# EAGLE design BPW5025-CRAM_Wing (EAGLE 5.06)
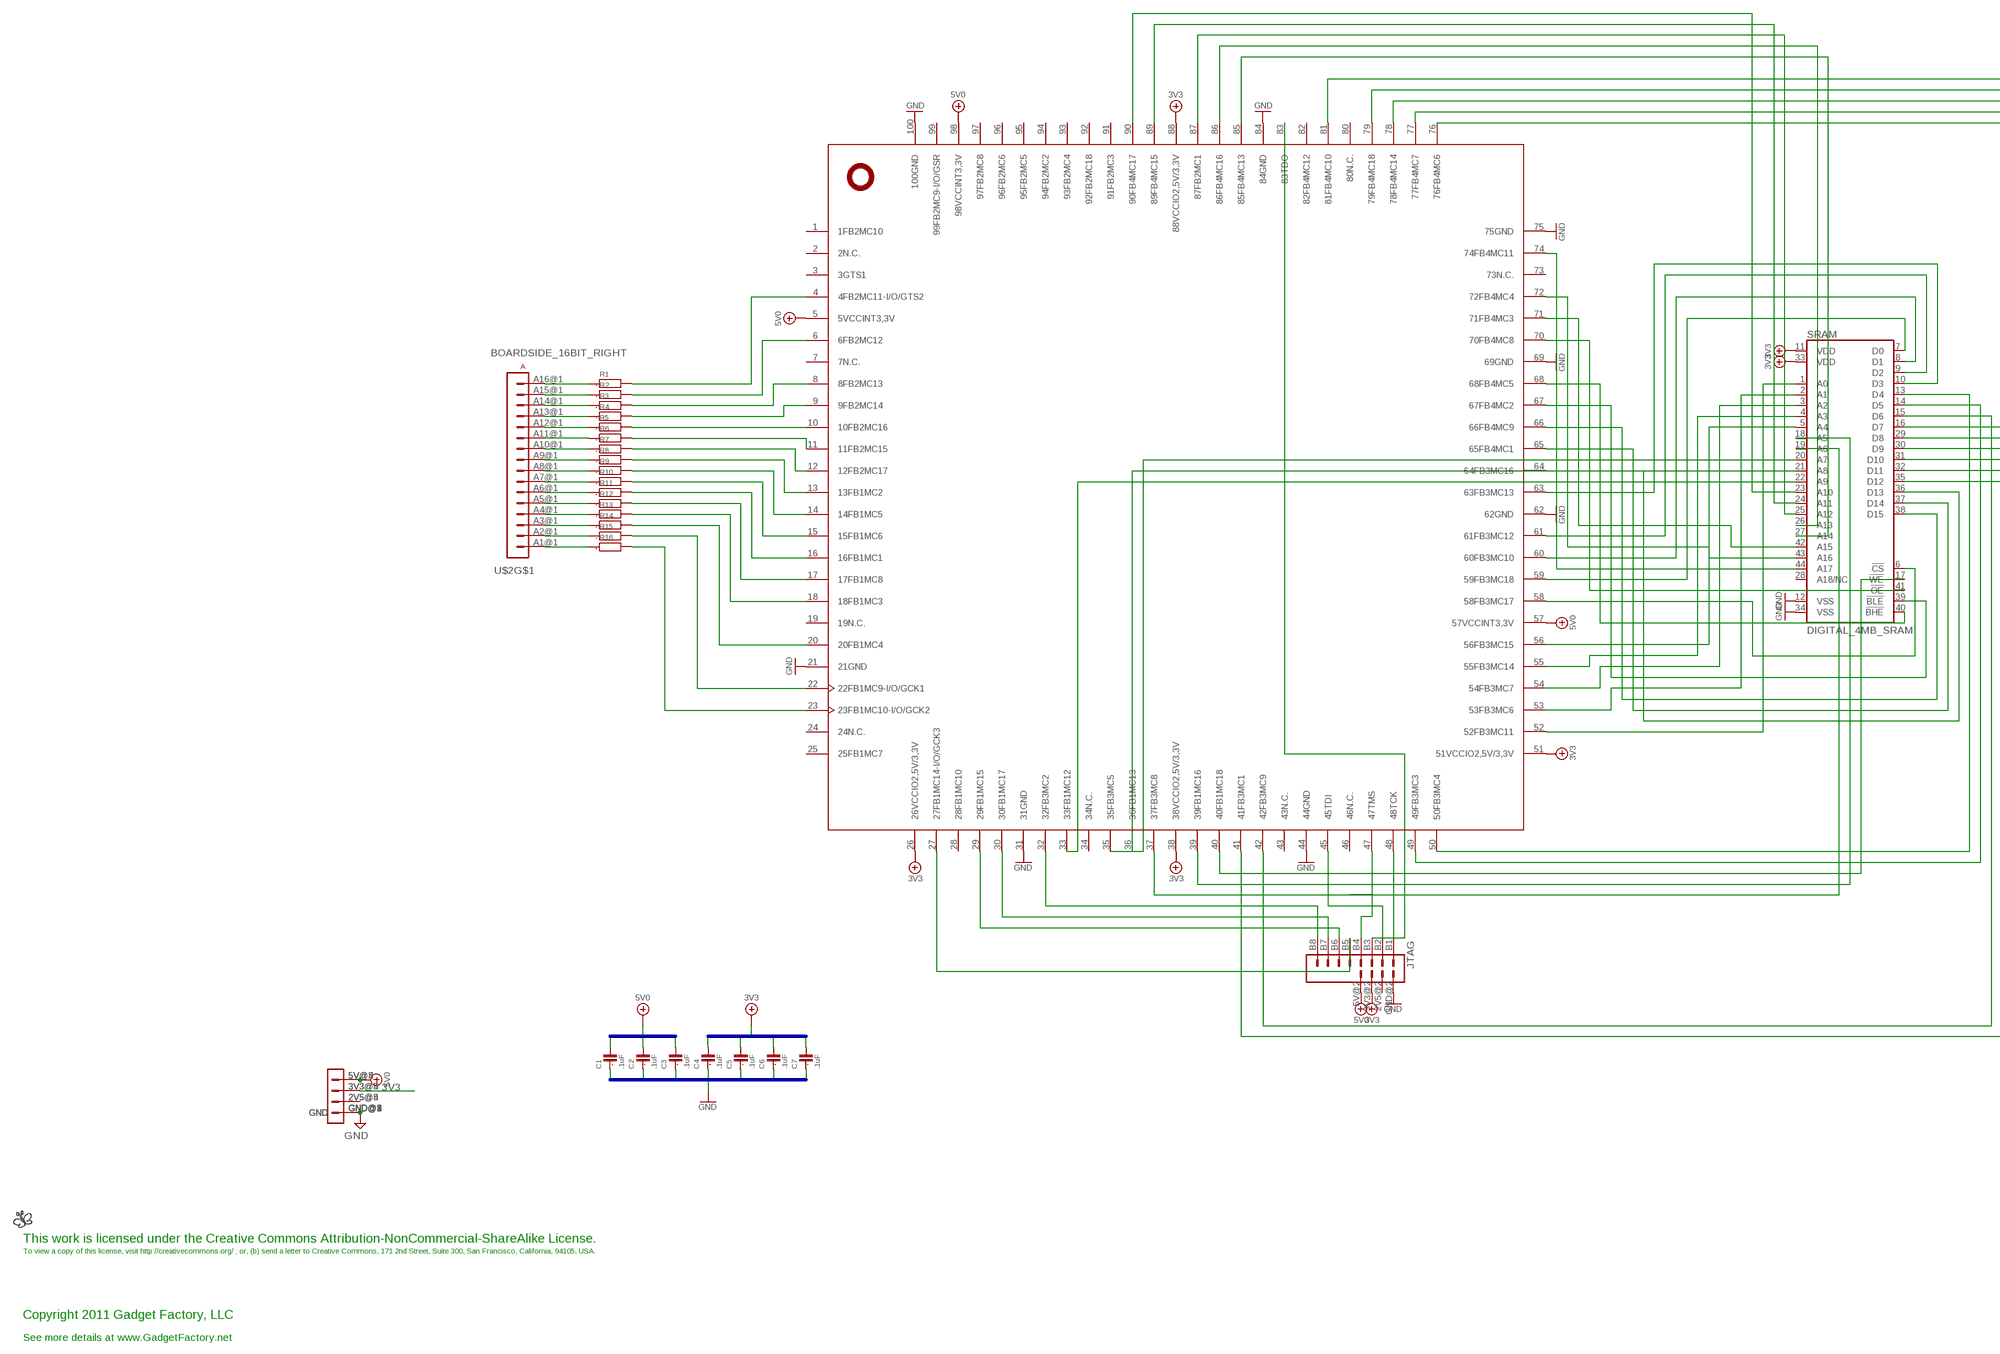
[diagram p0: schematic, sheet 1]

## Parts
C1  .1uF  C0805  [0805]
C2  .1uF  C0805  [0805]
C3  .1uF  C0805  [0805]
C4  .1uF  C0805  [0805]
C5  .1uF  C0805  [0805]
C6  .1uF  C0805  [0805]
C7  .1uF  C0805  [0805]
JTAG  WING_8BIT  [WINGSIDE_8BIT]
LOGO1  BUTTERFLY_LOGO  [BUTTERFLY_LOGO]
R1  R0603  [0603]
R2  R0603  [0603]
R3  R0603  [0603]
R4  R0603  [0603]
R5  R0603  [0603]
R6  R0603  [0603]
R7  R0603  [0603]
R8  R0603  [0603]
R9  R0603  [0603]
R10  R0603  [0603]
R11  R0603  [0603]
R12  R0603  [0603]
R13  R0603  [0603]
R14  R0603  [0603]
R15  R0603  [0603]
R16  R0603  [0603]
SRAM  DIGITAL_4MB_SRAM  [TSOP44-II]
U$2  BOARDSIDE_16BIT_RIGHT  [BOARDSIDE_16BIT_RIGHT]
XC9500  XC9572XLTQ100  [TQ100]

## Nets
3V3: C4.2 C5.2 C6.2 C7.2 JTAG.3V3@2(3V3) SRAM.11(VDD) SRAM.33(VDD) U$2.3V3@4(3V3) U$2.3V3@5(3V3) XC9500.26(26VCCIO2,5V/3,3V) XC9500.38(38VCCIO2,5V/3,3V) XC9500.51(51VCCIO2,5V/3,3V) XC9500.88(88VCCIO2,5V/3,3V)
5V0: C1.2 C2.2 C3.2 JTAG.5V@2(5V) U$2.5V@4(5V) U$2.5V@5(5V) XC9500.5(5VCCINT3,3V) XC9500.57(57VCCINT3,3V) XC9500.98(98VCCINT3,3V)
GND: C1.1 C2.1 C3.1 C4.1 C5.1 C6.1 C7.1 JTAG.GND@2(GND) SRAM.12(VSS) SRAM.34(VSS) U$2.GND@1(GND) U$2.GND@2(GND) U$2.GND@4(GND) U$2.GND@5(GND) XC9500.21(21GND) XC9500.31(31GND) XC9500.44(44GND) XC9500.62(62GND) XC9500.69(69GND) XC9500.75(75GND) XC9500.84(84GND) XC9500.100(100GND)
N$1: JTAG.B1 XC9500.48(48TCK)
N$2: R1.2 XC9500.4(4FB2MC11-I/O/GTS2)
N$3: U$2.2V5@4(2V5) U$2.2V5@5(2V5)
N$4: R2.2 XC9500.6(6FB2MC12)
N$5: R3.2 XC9500.8(8FB2MC13)
N$6: R4.2 XC9500.9(9FB2MC14)
N$7: R1.1 U$2.A16@1(A16)
N$8: R6.2 XC9500.11(11FB2MC15)
N$9: R7.2 XC9500.12(12FB2MC17)
N$10: R8.2 XC9500.13(13FB1MC2)
N$11: R9.2 XC9500.14(14FB1MC5)
N$12: R10.2 XC9500.15(15FB1MC6)
N$13: R11.2 XC9500.16(16FB1MC1)
N$14: R12.2 XC9500.17(17FB1MC8)
N$15: R13.2 XC9500.18(18FB1MC3)
N$16: R14.2 XC9500.20(20FB1MC4)
N$17: R15.2 XC9500.22(22FB1MC9-I/O/GCK1)
N$18: R16.2 XC9500.23(23FB1MC10-I/O/GCK2)
N$19: SRAM.1(A0) XC9500.52(52FB3MC11)
N$20: SRAM.2(A1) XC9500.53(53FB3MC6)
N$21: SRAM.3(A2) XC9500.54(54FB3MC7)
N$22: SRAM.4(A3) XC9500.55(55FB3MC14)
N$23: SRAM.6(!CS) XC9500.58(58FB3MC17)
N$24: SRAM.7(D0) XC9500.59(59FB3MC18)
N$25: SRAM.8(D1) XC9500.60(60FB3MC10)
N$26: SRAM.9(D2) XC9500.61(61FB3MC12)
N$27: SRAM.10(D3) XC9500.63(63FB3MC13)
N$28: SRAM.41(!OE) XC9500.70(70FB4MC8)
N$29: SRAM.44(A17) XC9500.74(74FB4MC11)
N$30: SRAM.43(A16) XC9500.72(72FB4MC4)
N$31: SRAM.42(A15) XC9500.71(71FB4MC3)
N$32: SRAM.40(!BHE) XC9500.68(68FB4MC5)
N$33: SRAM.39(!BLE) XC9500.67(67FB4MC2)
N$34: SRAM.38(D15) XC9500.66(66FB4MC9)
N$35: SRAM.37(D14) XC9500.65(65FB4MC1)
N$36: SRAM.36(D13) XC9500.64(64FB3MC16)
N$37: JTAG.B2 XC9500.45(45TDI)
N$39: JTAG.B4 XC9500.47(47TMS)
N$40: JTAG.B3 XC9500.83(83TDO)
N$41: SRAM.13(D4) XC9500.50(50FB3MC4)
N$42: SRAM.14(D5) XC9500.49(49FB3MC3)
N$43: SRAM.15(D6) XC9500.42(42FB3MC9)
N$44: SRAM.16(D7) XC9500.41(41FB3MC1)
N$45: SRAM.17(!WE) XC9500.40(40FB1MC18)
N$46: SRAM.18(A5) XC9500.39(39FB1MC16)
N$47: SRAM.19(A6) XC9500.37(37FB3MC8)
N$48: SRAM.20(A7) XC9500.36(36FB1MC13)
N$49: SRAM.21(A8) XC9500.35(35FB3MC5)
N$50: SRAM.22(A9) XC9500.33(33FB1MC12)
N$51: SRAM.35(D12) XC9500.76(76FB4MC6)
N$52: SRAM.32(D11) XC9500.77(77FB4MC7)
N$53: SRAM.31(D10) XC9500.78(78FB4MC14)
N$54: SRAM.30(D9) XC9500.79(79FB4MC18)
N$55: SRAM.29(D8) XC9500.81(81FB4MC10)
N$56: SRAM.27(A14) XC9500.85(85FB4MC13)
N$57: SRAM.26(A13) XC9500.86(86FB4MC16)
N$58: SRAM.25(A12) XC9500.87(87FB2MC1)
N$59: SRAM.24(A11) XC9500.89(89FB4MC15)
N$60: SRAM.23(A10) XC9500.90(90FB4MC17)
N$61: SRAM.5(A4) XC9500.56(56FB3MC15)
N$62: JTAG.B8 XC9500.32(32FB3MC2)
N$63: JTAG.B7 XC9500.30(30FB1MC17)
N$64: JTAG.B6 XC9500.29(29FB1MC15)
N$65: JTAG.B5 XC9500.27(27FB1MC14-I/O/GCK3)
N$66: R2.1 U$2.A15@1(A15)
N$67: R3.1 U$2.A14@1(A14)
N$68: R4.1 U$2.A13@1(A13)
N$69: R5.1 U$2.A12@1(A12)
N$70: R6.1 U$2.A11@1(A11)
N$71: R7.1 U$2.A10@1(A10)
N$72: R8.1 U$2.A9@1(A9)
N$73: R9.1 U$2.A8@1(A8)
N$74: R10.1 U$2.A7@1(A7)
N$75: R11.1 U$2.A6@1(A6)
N$76: R12.1 U$2.A5@1(A5)
N$77: R13.1 U$2.A4@1(A4)
N$78: R14.1 U$2.A3@1(A3)
N$79: R15.1 U$2.A2@1(A2)
N$80: R16.1 U$2.A1@1(A1)
N$81: R5.2 XC9500.10(10FB2MC16)
Unconnected: JTAG.2V5@2(2V5) SRAM.28(A18/NC) XC9500.1(1FB2MC10) XC9500.2(2N.C.) XC9500.3(3GTS1) XC9500.7(7N.C.) XC9500.19(19N.C.) XC9500.24(24N.C.) XC9500.25(25FB1MC7) XC9500.28(28FB1MC10) XC9500.34(34N.C.) XC9500.43(43N.C.) XC9500.46(46N.C.) XC9500.73(73N.C.) XC9500.80(80N.C.) XC9500.82(82FB4MC12) XC9500.91(91FB2MC3) XC9500.92(92FB2MC18) XC9500.93(93FB2MC4) XC9500.94(94FB2MC2) XC9500.95(95FB2MC5) XC9500.96(96FB2MC6) XC9500.97(97FB2MC8) XC9500.99(99FB2MC9-I/O/GSR)

## Buses
GND
5V0
3V3

## Notes on the sheet
- This work is licensed under the Creative Commons Attribution-NonCommercial-ShareAlike License.
- To view a copy of this license, visit http://creativecommons.org/ ; or, (b) send a letter to Creative Commons, 171 2nd Street, Suite 300, San Francisco, California, 94105, USA.
- Copyright 2011 Gadget Factory, LLC
- See more details at www.GadgetFactory.net

## Library data of the parts
C1-C7 = GadgetFactory:C: CAPACITOR, European symbol
JTAG = GadgetFactory_Pub:WING_8BIT
LOGO1 = GadgetFactory_Pub:BUTTERFLY_LOGO
R1-R16 = GadgetFactory:R: RESISTOR, European symbol
SRAM = Bogdan_Commons:DIGITAL_4MB_SRAM
U$2 = GadgetFactory_Pub:BOARDSIDE_16BIT_RIGHT
XC9500 = xilinx_xc9572xl-tq100:XC9572XLTQ100

## Board
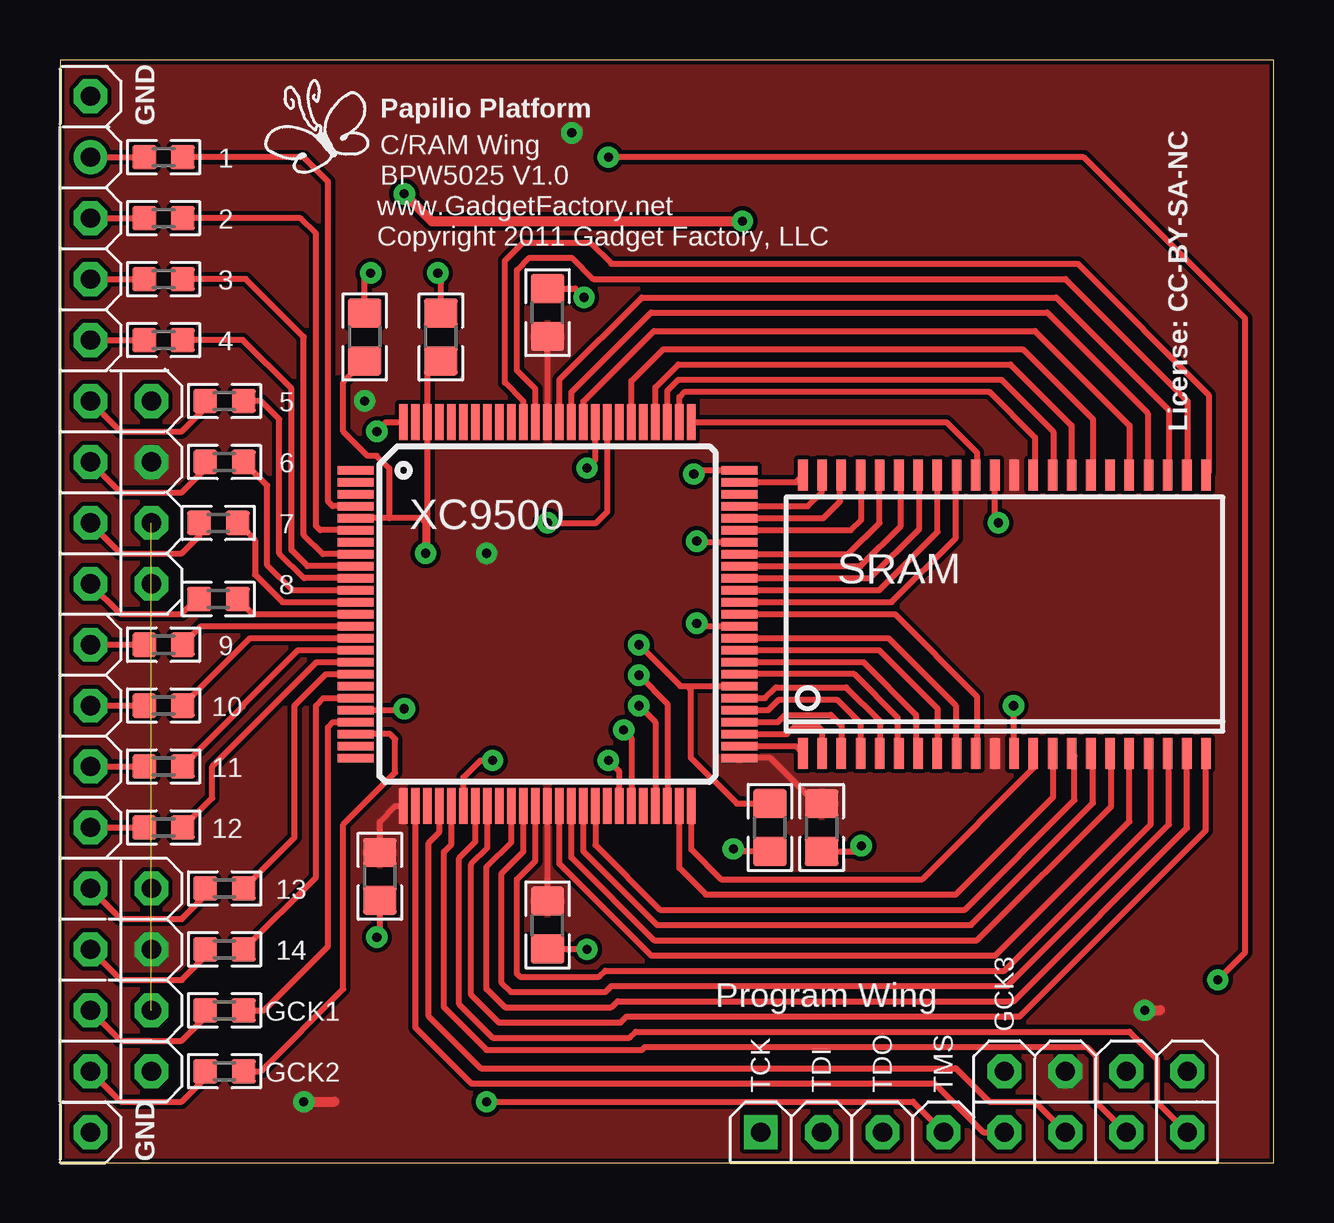
[diagram p1: board, top side]
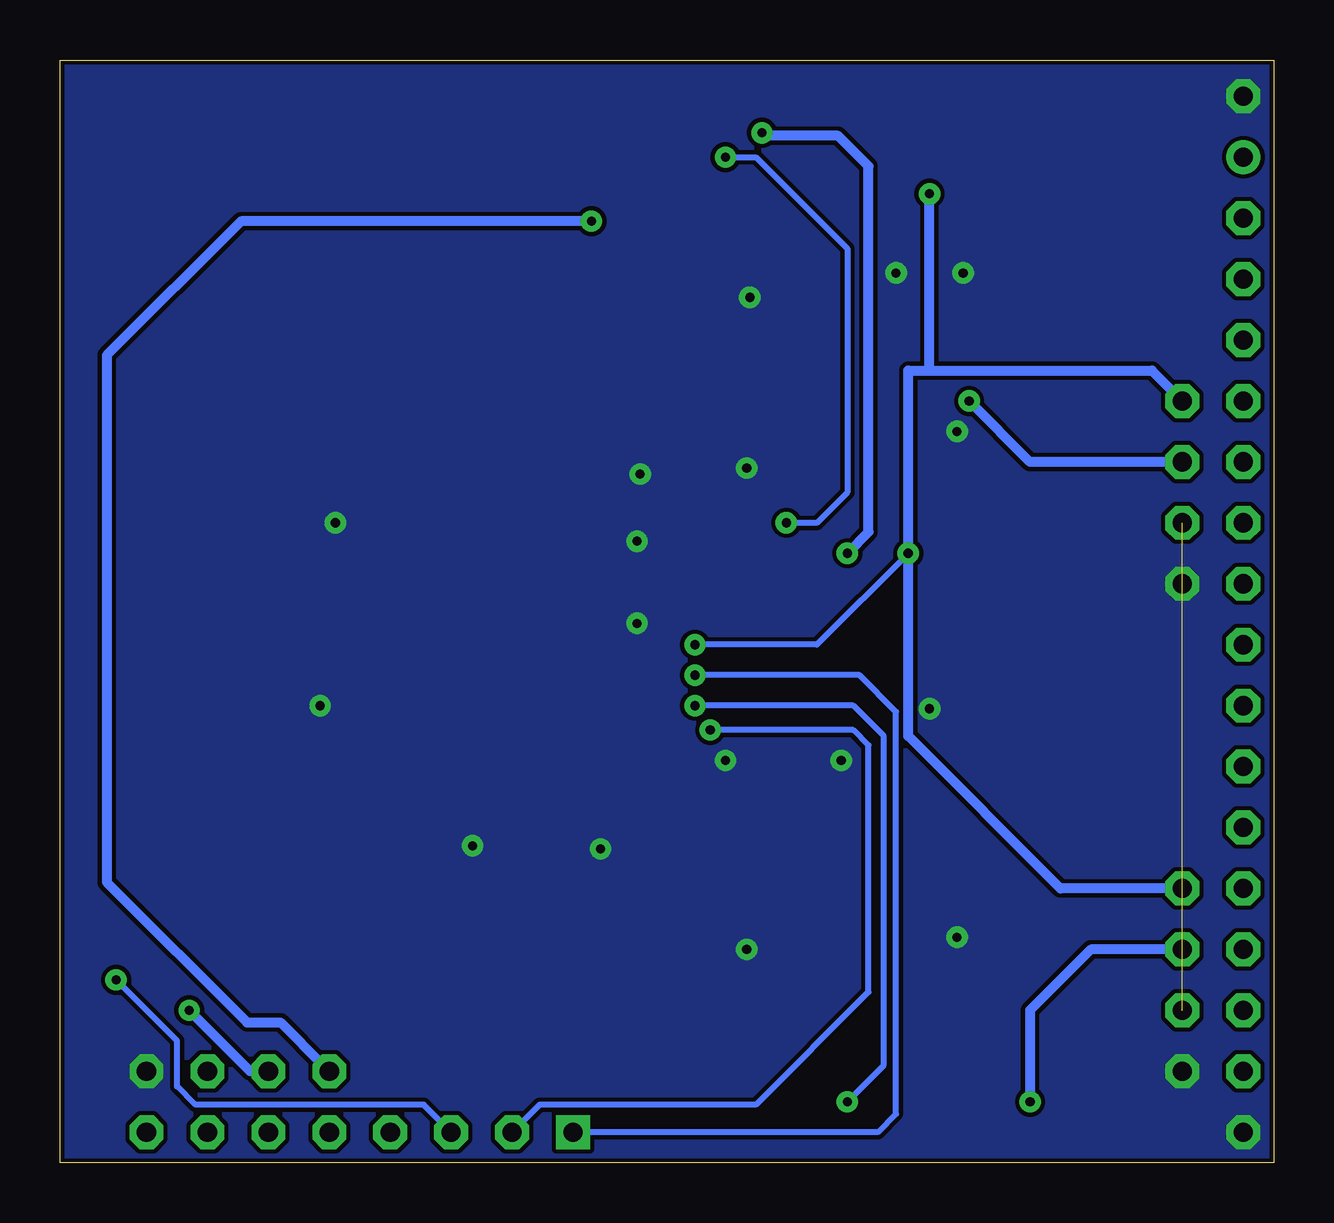
[diagram p2: board, bottom side, seen from below]

Size 50.6 x 45.96 mm. Coordinates in mm from the lower left corner, seen from the top.
Outline: 0,0 50.6,0 50.6,45.96 0,45.96 0,0
Copper layers (1*16): Top 0.035mm / dielectric 1.5mm / Bottom 0.035mm
Design rules "SparkFun_Derived_GoldePheonix_7mil *": minimum track width 7mil, minimum drill 15mil, track to track 7mil, track to pad 7mil, pad to pad 7mil, via to via 7mil, smd to smd 7mil, copper to edge 7mil, drill to drill 7mil, minimum pad ring 12mil, minimum via ring 10mil, stop-mask expansion 4mil, vias tented up to drill 18mil, thermal gap 1mil

### Footprints (pad centres in the part's own frame; a part is rotated, then mirrored left to right if it is on the bottom)
0805 = smd 1.2 x 1.4: 1 -1,0; 2 1,0
WINGSIDE_8BIT = drill 0.8 octagon: 2V5@2 16.51,3.81; 3V3@2 13.97,3.81; 5V@2 11.43,3.81; B2 3.81,1.27; B3 6.35,1.27; B4 8.89,1.27; B5 11.43,1.27; B6 13.97,1.27; B7 16.51,1.27; B8 19.05,1.27; GND@2 19.05,3.81 | drill 0.8 square: B1 1.27,1.27
0603 = smd 1 x 1: 1 -0.8,0; 2 0.8,0
TSOP44-II = smd 0.4 x 1.3: 1 -8.4,-5.8; 2 -7.6,-5.8; 3 -6.8,-5.8; 4 -6,-5.8; 5 -5.2,-5.8; 6 -4.4,-5.8; 7 -3.6,-5.8; 8 -2.8,-5.8; 9 -2,-5.8; 10 -1.2,-5.8; 11 -0.4,-5.8; 12 0.4,-5.8; 13 1.2,-5.8; 14 2,-5.8; 15 2.8,-5.8; 16 3.6,-5.8; 17 4.4,-5.8; 18 5.2,-5.8; 19 6,-5.8; 20 6.8,-5.8; 21 7.6,-5.8; 22 8.4,-5.8; 23 8.4,5.8; 24 7.6,5.8; 25 6.8,5.8; 26 6,5.8; 27 5.2,5.8; 28 4.4,5.8; 29 3.6,5.8; 30 2.8,5.8; 31 2,5.8; 32 1.2,5.8; 33 0.4,5.8; 34 -0.4,5.8; 35 -1.2,5.8; 36 -2,5.8; 37 -2.8,5.8; 38 -3.6,5.8; 39 -4.4,5.8; 40 -5.2,5.8; 41 -6,5.8; 42 -6.8,5.8; 43 -7.6,5.8; 44 -8.4,5.8
BOARDSIDE_16BIT_RIGHT = drill 0.8 octagon: 2V5@4 3.81,-16.51; 2V5@5 3.81,3.81; 3V3@4 3.81,-13.97; 3V3@5 3.81,6.35; 5V@4 3.81,-11.43; 5V@5 3.81,8.89; A1@1 1.27,-19.05; A2@1 1.27,-16.51; A3@1 1.27,-13.97; A4@1 1.27,-11.43; A5@1 1.27,-8.89; A6@1 1.27,-6.35; A7@1 1.27,-3.81; A8@1 1.27,-1.27; A9@1 1.27,1.27; A10@1 1.27,3.81; A11@1 1.27,6.35; A12@1 1.27,8.89; A13@1 1.27,11.43; A14@1 1.27,13.97; A15@1 1.27,16.51; GND@1 1.27,-21.59; GND@2 1.27,21.59; GND@4 3.81,-19.05; GND@5 3.81,1.27 | drill 0.8 round: A16@1 1.27,19.05
TQ100 = smd 1.5 x 0.35: 1 -4.19,3.46; 2 -4.19,2.96; 3 -4.19,2.46; 4 -4.19,1.96; 5 -4.19,1.46; 6 -4.19,0.96; 7 -4.19,0.46; 8 -4.19,-0.04; 9 -4.19,-0.54; 10 -4.19,-1.04; 11 -4.19,-1.54; 12 -4.19,-2.04; 13 -4.19,-2.54; 14 -4.19,-3.04; 15 -4.19,-3.54; 16 -4.19,-4.04; 17 -4.19,-4.54; 18 -4.19,-5.04; 19 -4.19,-5.54; 20 -4.19,-6.04; 21 -4.19,-6.54; 22 -4.19,-7.04; 23 -4.19,-7.54; 24 -4.19,-8.04; 25 -4.19,-8.54; 51 11.81,-8.54; 52 11.81,-8.04; 53 11.81,-7.54; 54 11.81,-7.04; 55 11.81,-6.54; 56 11.81,-6.04; 57 11.81,-5.54; 58 11.81,-5.04; 59 11.81,-4.54; 60 11.81,-4.04; 61 11.81,-3.54; 62 11.81,-3.04; 63 11.81,-2.54; 64 11.81,-2.04; 65 11.81,-1.54; 66 11.81,-1.04; 67 11.81,-0.54; 68 11.81,-0.04; 69 11.81,0.46; 70 11.81,0.96; 71 11.81,1.46; 72 11.81,1.96; 73 11.81,2.46; 74 11.81,2.96; 75 11.81,3.46 | smd 0.35 x 1.5: 26 -2.19,-10.54; 27 -1.69,-10.54; 28 -1.19,-10.54; 29 -0.69,-10.54; 30 -0.19,-10.54; 31 0.31,-10.54; 32 0.81,-10.54; 33 1.31,-10.54; 34 1.81,-10.54; 35 2.31,-10.54; 36 2.81,-10.54; 37 3.31,-10.54; 38 3.81,-10.54; 39 4.31,-10.54; 40 4.81,-10.54; 41 5.31,-10.54; 42 5.81,-10.54; 43 6.31,-10.54; 44 6.81,-10.54; 45 7.31,-10.54; 46 7.81,-10.54; 47 8.31,-10.54; 48 8.81,-10.54; 49 9.31,-10.54; 50 9.81,-10.54; 76 9.81,5.46; 77 9.31,5.46; 78 8.81,5.46; 79 8.31,5.46; 80 7.81,5.46; 81 7.31,5.46; 82 6.81,5.46; 83 6.31,5.46; 84 5.81,5.46; 85 5.31,5.46; 86 4.81,5.46; 87 4.31,5.46; 88 3.81,5.46; 89 3.31,5.46; 90 2.81,5.46; 91 2.31,5.46; 92 1.81,5.46; 93 1.31,5.46; 94 0.81,5.46; 95 0.31,5.46; 96 -0.19,5.46; 97 -0.69,5.46; 98 -1.19,5.46; 99 -1.69,5.46; 100 -2.19,5.46

### Placement (x,y rotation side)
C1  12.7,34.42 270 top
C2  29.59,13.97 90 top
C3  15.88,34.42 270 top
C4  13.34,11.94 90 top
C5  20.32,9.91 90 top
C6  31.75,13.97 90 top
C7  20.32,35.43 270 top
JTAG  27.94,0 0 top
LOGO1  10.79,42.67 0 top
R1  4.32,41.91 0 top
R2  4.32,39.37 0 top
R3  4.32,36.83 0 top
R4  4.32,34.29 0 top
R5  6.86,31.75 0 top
R6  6.86,29.21 0 top
R7  6.6,26.67 0 top
R8  6.6,23.5 0 top
R9  4.32,21.59 0 top
R10  4.32,19.05 0 top
R11  4.32,16.51 0 top
R12  4.32,13.97 0 top
R13  6.86,11.43 0 top
R14  6.86,8.89 0 top
R15  6.86,6.35 0 top
R16  6.86,3.81 0 top
SRAM  39.37,22.86 0 top
U$2  0,22.86 0 top
XC9500  16.51,25.4 0 top

### Tracks (layer width: path | path; a pad name or v marks a point on that pad's centre or on a via)
3V3  (via drill 0.38)
  Top 0.254: XC9500.88 C7.2 | C6.2 31.75,15.24 31.24,15.24 29.62,16.86 XC9500.51 | C5.2 XC9500.38 | XC9500.26 13.97,14.86 13.34,14.22 C4.2
  Top 0.406: v10.16,2.54 11.43,2.54 | v12.7,31.75 12.95,31.75 | v45.21,6.35 45.85,6.35 | v21.34,42.93 21.46,42.93 21.59,43.05
  Bottom 0.406: U$2.3V3@4 7.62,8.89 10.16,6.35 v10.16,2.54 | U$2.3V3@5 10.16,29.21 v12.7,31.75 | JTAG.3V3@2 42.67,3.81 v45.21,6.35 | v21.34,42.93 21.21,42.8 18.16,42.8 16.89,41.53 16.89,26.29 v17.78,25.4
  pour Top: 0.13,45.85 50.42,45.85 50.42,0.13 0.13,0.13
5V0  (via drill 0.38)
  Top 0.254: 13.74,26.86 15.05,26.86 15.24,26.67 v15.24,25.4 15.32,25.48 XC9500.98 15.32,32.86 C3.2 | 13.74,26.86 XC9500.5 | 26.16,19.86 25.86,19.86 v24.13,21.59 | 26.16,19.86 XC9500.57 | 13.74,26.86 13.74,28.94 13.21,29.46 12.83,29.46 11.81,30.48 11.81,32.53 C1.2 | 26.16,19.86 26.29,19.73 26.29,16.89 28.21,14.97 C2.2
  Top 0.406: v28.45,39.24 15.49,39.24 v14.35,40.39
  Bottom 0.254: v24.13,21.59 19.05,21.59 v15.24,25.4
  Bottom 0.406: U$2.5V@4 8.89,11.43 15.24,17.78 v15.24,25.4 15.24,33.02 14.48,33.02 | JTAG.5V@2 39.62,3.81 39.62,4.06 41.4,5.84 42.8,5.84 48.64,11.68 48.64,33.66 43.05,39.24 v28.45,39.24 | v14.35,40.39 14.35,33.15 14.48,33.02 | 14.48,33.02 5.08,33.02 U$2.5V@5
GND  (via drill 0.38)
  Top 0.254: SRAM.34 38.97,26.82 v39.12,26.67 | SRAM.12 39.77,19.03 v39.75,19.05 | XC9500.75 26.57,28.86 v26.42,28.7 | XC9500.69 26.59,25.86 v26.54,25.91 | XC9500.62 26.66,22.36 v26.54,22.48 | XC9500.84 22.32,29.3 v21.97,28.96 | XC9500.21 14.29,18.86 v14.35,18.92 | XC9500.31 16.82,16.06 17.53,16.76 v18.03,16.76 | XC9500.44 23.32,16.3 v22.86,16.76 | XC9500.100 13.59,30.86 v13.21,30.48 | C1.1 12.7,36.83 v12.95,37.08 | C3.1 15.88,36.96 v15.75,37.08 | C4.1 13.34,9.53 v13.21,9.4 | C5.1 21.95,8.91 v21.97,8.89 | C2.1 28.18,12.97 v28.07,13.08 | C6.1 33.16,12.97 v33.4,13.21 | C7.1 21.48,36.43 v21.84,36.07
  Bottom 0.254: v39.12,26.67 39.24,26.67 | v39.75,19.05 39.88,19.18 | v26.42,28.7 26.42,28.57 | v26.54,25.91 26.54,26.04 | v26.54,22.48 26.54,22.61 | v21.97,28.96 21.84,28.96 | v14.35,18.92 14.35,19.05 | v18.03,16.76 18.16,16.76 | v22.86,16.76 22.73,16.76 | 13.21,30.35 v13.21,30.48 | v12.95,37.08 13.21,37.08 | v15.75,37.08 15.62,37.08 | v13.21,9.4 13.08,9.4 | v21.97,8.89 21.97,8.76 | v28.07,13.08 28.19,13.21 | v33.4,13.21 33.4,13.34 | v21.84,36.07 21.84,35.81
  pour Bottom: 0.13,45.85 50.42,45.85 50.42,0.13 0.13,0.13
N$1  (via drill 0.38)
  Top 0.254: XC9500.48 25.32,19.13 v24.13,20.32
  Bottom 0.254: v24.13,20.32 17.27,20.32 15.75,18.8 15.75,2.03 16.51,1.27 JTAG.B1
N$2
  Top 0.254: XC9500.4 11.38,27.36 11.18,27.56 11.18,40.89 10.16,41.91 R1.2
N$3  (1 unrouted)
N$4
  Top 0.254: XC9500.6 10.85,26.36 10.67,26.54 10.67,38.73 10.03,39.37 R2.2
N$5
  Top 0.254: XC9500.8 10.96,25.36 10.16,26.16 10.16,34.42 7.75,36.83 R3.2
N$6
  Top 0.254: XC9500.9 10.32,24.86 9.65,25.53 9.65,32.26 7.62,34.29 R4.2
N$7
  Top 0.254: U$2.A16@1 R1.1
N$8
  Top 0.254: XC9500.11 9.67,23.86 8.64,24.89 8.64,28.23 R6.2
N$9
  Top 0.254: XC9500.12 9.28,23.36 8.13,24.51 8.13,25.95 R7.2
N$10
  Top 0.254: XC9500.13 8.04,22.86 R8.2
N$11
  Top 0.254: XC9500.14 5.89,22.36 R9.2
N$12
  Top 0.254: XC9500.15 7.93,21.86 R10.2
N$13
  Top 0.254: XC9500.16 9.93,21.36 7.62,19.05 7.62,19.01 R11.2
N$14
  Top 0.254: XC9500.17 10.7,20.86 6.35,16.51 6.35,15.2 R12.2
N$15
  Top 0.254: XC9500.18 11.09,20.36 9.78,19.05 9.78,13.55 R13.2
N$16
  Top 0.254: XC9500.20 10.98,19.36 10.67,19.05 10.67,11.9 R14.2
N$17
  Top 0.254: XC9500.22 11.38,18.36 11.18,18.16 11.18,9.02 8.51,6.35 R15.2
N$18
  Top 0.254: XC9500.23 13.76,17.86 13.97,17.65 13.97,16.26 11.81,14.1 11.81,7.24 8.38,3.81 R16.2
N$19
  Top 0.254: XC9500.52 30.67,17.36 SRAM.1
N$20
  Top 0.254: SRAM.2 31.77,18.01 31.62,18.16 30.61,18.16 30.31,17.86 XC9500.53
N$21
  Top 0.254: XC9500.54 29.92,18.36 30.23,18.67 32.13,18.67 32.57,18.23 SRAM.3
N$22
  Top 0.254: XC9500.55 29.53,18.86 29.97,19.3 32.38,19.3 33.37,18.32 SRAM.4
N$23
  Top 0.254: XC9500.58 33.11,20.36 34.92,18.54 34.92,17.11 SRAM.6
N$24
  Top 0.254: XC9500.59 33.5,20.86 35.69,18.67 35.69,17.14 SRAM.7
N$25
  Top 0.254: XC9500.60 34.14,21.36 36.58,18.92 SRAM.8
N$26
  Top 0.254: XC9500.61 34.53,21.86 37.34,19.05 37.34,17.09 SRAM.9
N$27
  Top 0.254: XC9500.63 34.8,22.86 38.23,19.43 38.23,17.12 SRAM.10
N$28
  Top 0.254: XC9500.70 32.96,26.36 33.4,26.8 33.4,28.63 SRAM.41
N$29
  Top 0.254: XC9500.74 30.67,28.36 SRAM.44
N$30
  Top 0.254: XC9500.72 31.17,27.36 31.75,27.94 31.75,28.64 SRAM.43
N$31
  Top 0.254: XC9500.71 31.81,26.86 32.51,27.56 32.51,28.6 SRAM.42
N$32
  Top 0.254: XC9500.68 32.85,25.36 34.16,26.67 SRAM.40
N$33
  Top 0.254: XC9500.67 33.37,24.86 35.05,26.54 35.05,28.58 SRAM.39
N$34
  Top 0.254: XC9500.66 33.76,24.36 35.81,26.42 35.81,28.62 SRAM.38
N$35
  Top 0.254: XC9500.65 34.15,23.86 36.58,26.29 SRAM.37
N$36
  Top 0.254: XC9500.64 34.66,23.36 37.34,26.04 37.34,28.63 SRAM.36
N$37  (via drill 0.38)
  Top 0.254: XC9500.45 23.82,17.71 v23.5,18.03
  Bottom 0.254: v23.5,18.03 17.53,18.03 16.89,17.4 16.89,7.11 21.59,2.41 30.61,2.41 JTAG.B2
N$39  (via drill 0.38)
  Top 0.254: XC9500.47 24.82,18.36 v24.13,19.05 | v17.78,2.54 35.56,2.54 JTAG.B4
  Bottom 0.254: v24.13,19.05 17.53,19.05 16.26,17.78 16.26,4.06 v17.78,2.54
N$40  (via drill 0.38)
  Top 0.254: XC9500.83 22.82,27.14 22.35,26.67 v20.32,26.67 | v22.86,41.91 42.67,41.91 49.4,35.18 49.4,8.76 v48.26,7.62
  Bottom 0.254: v20.32,26.67 19.05,26.67 17.78,27.94 17.78,38.1 21.59,41.91 v22.86,41.91 | JTAG.B3 35.43,2.41 44.96,2.41 45.72,3.17 45.72,5.08 v48.26,7.62
N$41
  Top 0.254: SRAM.13 40.64,16.99 40.64,16.51 35.94,11.81 27.56,11.81 26.32,13.05 XC9500.50
N$42
  Top 0.254: SRAM.14 41.4,17.03 41.4,15.24 37.34,11.18 26.92,11.18 25.82,12.28 XC9500.49
N$43
  Top 0.254: SRAM.15 42.29,16.94 42.29,15.11 37.72,10.54 25.02,10.54 22.32,13.24 XC9500.42
N$44
  Top 0.254: SRAM.16 43.05,16.98 43.05,14.99 37.97,9.91 24.89,9.91 21.82,12.98 XC9500.41
N$45
  Top 0.254: SRAM.17 43.81,17.02 43.81,14.86 38.23,9.27 24.77,9.27 21.32,12.72 XC9500.40
N$46
  Top 0.254: SRAM.18 44.58,14.22 38.99,8.64 24.64,8.64 20.82,12.45 XC9500.39
N$47
  Top 0.254: SRAM.19 45.47,16.96 45.47,14.1 39.37,8 22.73,8 22.48,7.75 19.18,7.75 19.05,7.87 19.05,11.81 19.82,12.58 XC9500.37
N$48
  Top 0.254: SRAM.20 46.23,17 46.23,14.1 39.5,7.37 22.99,7.37 22.73,7.11 18.8,7.11 18.41,7.49 18.41,12.06 19.32,12.97 XC9500.36
N$49
  Top 0.254: SRAM.21 46.97,13.95 39.75,6.73 23.24,6.73 22.99,6.48 18.54,6.48 17.78,7.24 17.78,12.32 18.82,13.36 XC9500.35
N$50
  Top 0.254: SRAM.22 47.75,17.04 47.75,13.84 40.01,6.1 23.62,6.1 23.37,5.84 18.29,5.84 17.14,6.99 17.14,12.45 17.82,13.12 XC9500.33
N$51
  Top 0.254: XC9500.76 36.96,30.86 38.23,29.59 38.23,28.72 SRAM.35
N$52
  Top 0.254: XC9500.77 25.82,31.92 26.04,32.13 38.73,32.13 40.64,30.23 40.64,28.73 SRAM.32
N$53
  Top 0.254: XC9500.78 25.32,32.18 25.78,32.64 39.24,32.64 41.4,30.48 41.4,28.69 SRAM.31
N$54
  Top 0.254: XC9500.79 24.82,32.31 25.78,33.27 39.62,33.27 42.16,30.73 SRAM.30
N$55
  Top 0.254: XC9500.81 23.82,32.58 25.15,33.91 40.13,33.91 43.05,30.99 43.05,28.74 SRAM.29
N$56
  Top 0.254: XC9500.85 21.82,31.73 24.77,34.67 40.64,34.67 44.58,30.73 SRAM.27
N$57
  Top 0.254: XC9500.86 21.32,32.12 24.64,35.43 41.15,35.43 45.34,31.24 45.34,28.69 SRAM.26
N$58
  Top 0.254: XC9500.87 20.82,32.63 24.26,36.07 41.53,36.07 46.23,31.37 46.23,28.72 SRAM.25
N$59
  Top 0.254: SRAM.24 46.99,28.68 46.99,31.75 41.91,36.83 22.23,36.83 21.34,37.72 19.56,37.72 19.05,37.21 19.05,33.02 19.82,32.25 XC9500.89
N$60
  Top 0.254: SRAM.23 47.88,28.77 47.88,32 42.42,37.47 22.99,37.47 22.1,38.35 19.3,38.35 18.54,37.59 18.54,32.51 19.32,31.73 XC9500.90
N$61
  Top 0.254: SRAM.5 34.17,18.41 32.77,19.81 29.84,19.81 29.39,19.36 XC9500.56
N$62
  Top 0.254: JTAG.B8 45.72,2.54 45.72,4.32 44.58,5.46 24,5.46 23.75,5.21 18.03,5.21 16.64,6.6 16.64,12.7 17.32,13.38 XC9500.32
N$63
  Top 0.254: JTAG.B7 43.18,2.54 43.18,4.45 42.8,4.83 24.38,4.83 24.26,4.7 17.78,4.7 16,6.48 16,12.95 16.32,13.27 XC9500.30
N$64
  Top 0.254: JTAG.B6 40.64,2.54 38.73,2.54 37.34,3.94 17.53,3.94 15.37,6.1 15.37,13.34 15.82,13.79 XC9500.29
N$65
  Top 0.254: XC9500.27 14.82,5.63 17.14,3.3 36.45,3.3 38.48,1.27 JTAG.B5
N$66
  Top 0.254: U$2.A15@1 R2.1
N$67
  Top 0.254: U$2.A14@1 R3.1
N$68
  Top 0.254: U$2.A13@1 R4.1
N$69
  Top 0.254: R5.1 6.06,31.46 5.08,30.48 2.54,30.48 U$2.A12@1
N$70
  Top 0.254: R6.1 6.06,28.92 5.08,27.94 2.54,27.94 U$2.A11@1
N$71
  Top 0.254: R7.1 5.8,26.12 5.08,25.4 2.54,25.4 U$2.A10@1
N$72
  Top 0.254: R8.1 5.71,23.5 5.08,22.86 2.54,22.86 U$2.A9@1
N$73
  Top 0.254: U$2.A8@1 R9.1
N$74
  Top 0.254: U$2.A7@1 R10.1
N$75
  Top 0.254: U$2.A6@1 R11.1
N$76
  Top 0.254: U$2.A5@1 R12.1
N$77
  Top 0.254: R13.1 6.06,11.14 5.08,10.16 2.54,10.16 U$2.A4@1
N$78
  Top 0.254: R14.1 6.06,8.6 5.08,7.62 2.54,7.62 U$2.A3@1
N$79
  Top 0.254: R15.1 6.06,6.06 5.08,5.08 2.54,5.08 U$2.A2@1
N$80
  Top 0.254: R16.1 6.06,3.52 5.08,2.54 2.54,2.54 U$2.A1@1
N$81
  Top 0.254: XC9500.10 10.18,24.36 9.14,25.4 9.14,30.99 8.38,31.75 R5.2

### Text on the board
tPlace: Papilio Platform | 1 | C/RAM Wing | BPW5025 V1.0 | 2 | www.GadgetFactory.net | Copyright 2011 Gadget Factory, LLC | 3 | 4 | 5 | 6 | License: CC-BY-SA-NC | 7 | 8 | 9 | 10 | 11 | 12 | 13 | 14 | GCK1 | Program Wing | GCK3 | GCK2 | TCK | TDI | TDO | TMS